# EAGLE design CC-USB-CB (EAGLE 6.1)
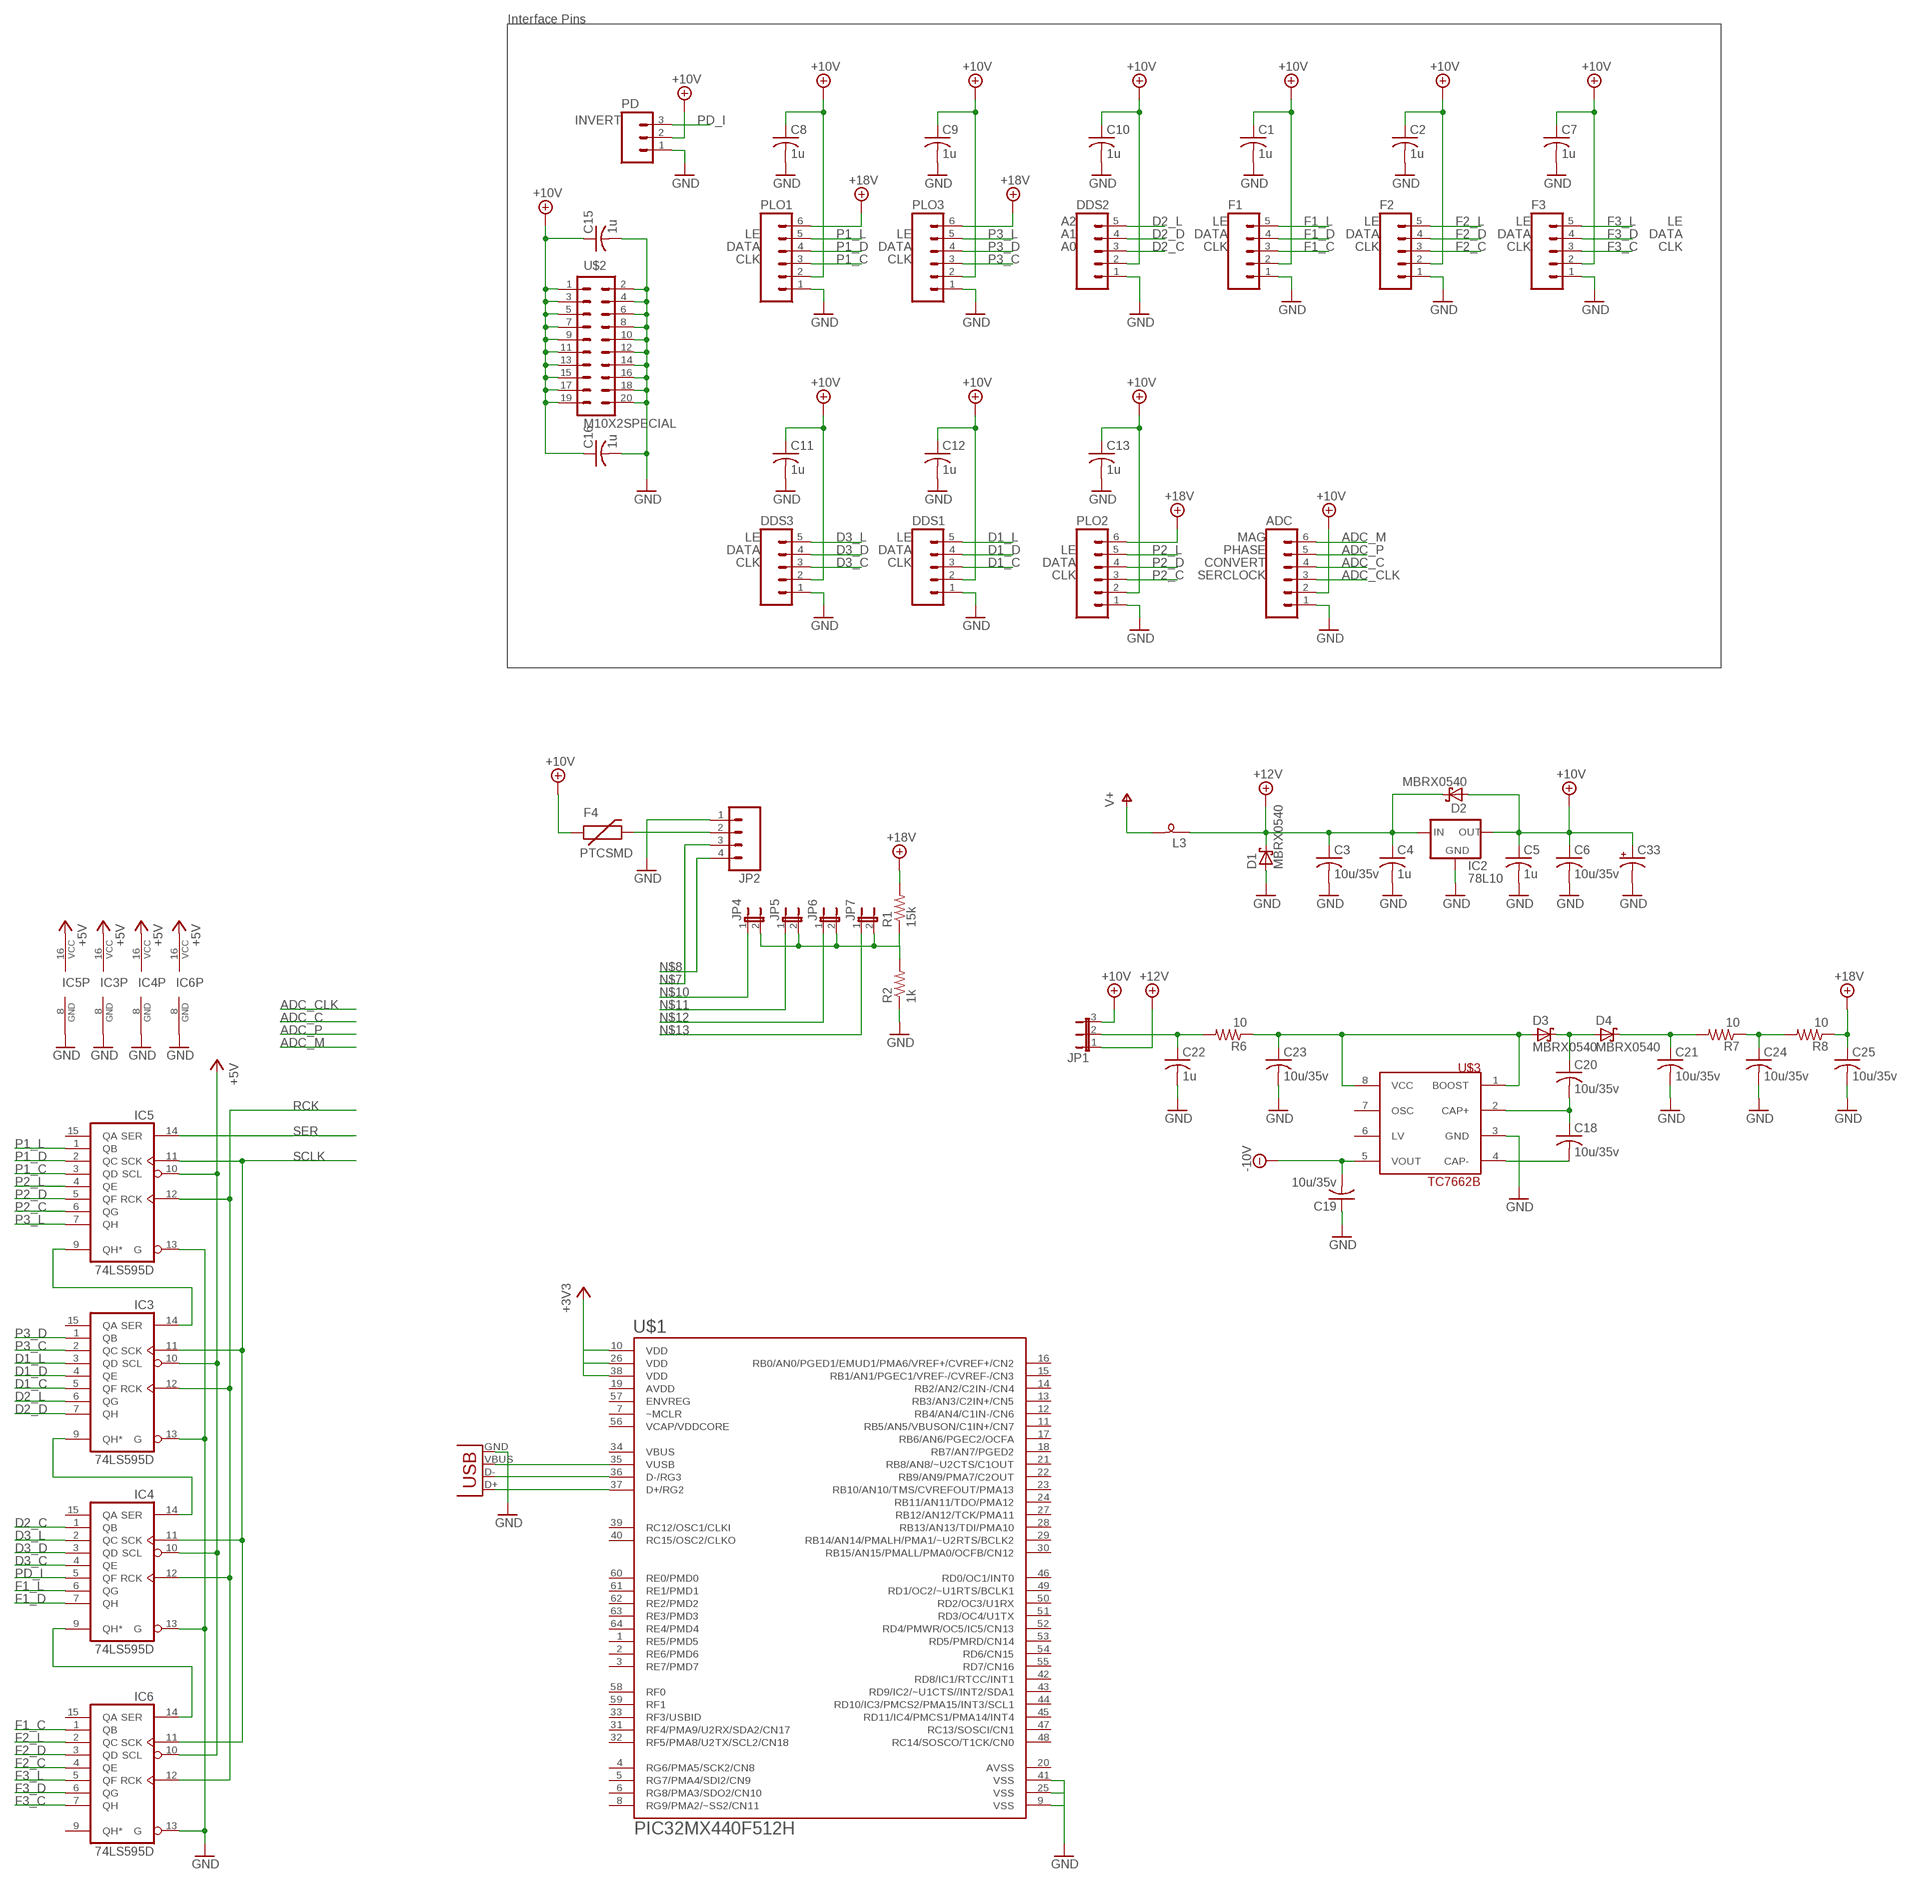
[diagram p0: schematic, sheet 1]

## Parts
ADC  M06LOCK  [1X06_LOCK]
C1  1u  C-USC0603  [C0603]
C2  1u  C-USC0603  [C0603]
C3  10u/35v  C-USC1206  [C1206]
C4  1u  C-USC0603  [C0603]
C5  1u  C-USC0603  [C0603]
C6  10u/35v  C-USC1206  [C1206]
C7  1u  C-USC0603  [C0603]
C8  1u  C-USC0603  [C0603]
C9  1u  C-USC0603  [C0603]
C10  1u  C-USC0603  [C0603]
C11  1u  C-USC0603  [C0603]
C12  1u  C-USC0603  [C0603]
C13  1u  C-USC0603  [C0603]
C15  1u  C-USC0603  [C0603]
C16  1u  C-USC0603  [C0603]
C18  10u/35v  C-USC1206  [C1206]
C19  10u/35v  C-USC1206  [C1206]
C20  10u/35v  C-USC1206  [C1206]
C21  10u/35v  C-USC1206  [C1206]
C22  1u  C-USC0603  [C0603]
C23  10u/35v  C-USC1206  [C1206]
C24  10u/35v  C-USC1206  [C1206]
C25  10u/35v  C-USC1206  [C1206]
C33  CPOL-USE2.5-6  [E2,5-6]
D1  MBRX0540  [SOD323-R]
D2  MBRX0540  [SOD323-R]
D3  MBRX0540  [SOD323-R]
D4  MBRX0540  [SOD323-R]
DDS1  M05LOCK  [1X05_LOCK]
DDS2  M05LOCK  [1X05_LOCK]
DDS3  M05LOCK  [1X05_LOCK]
F1  M05LOCK  [1X05_LOCK]
F2  M05LOCK  [1X05_LOCK]
F3  M05LOCK  [1X05_LOCK]
F4  PTCSMD  [PTC-1206]
IC2  78L10  78XXS  [78XXS]
IC3  74LS595D  [SO16]
IC4  74LS595D  [SO16]
IC5  74LS595D  [SO16]
IC6  74LS595D  [SO16]
JP1  JP2E  [JP2]
JP2  M04LOCK  [1X04_LOCK]
JP4  JUMPER-2SMD-NO  [SJ_2S-NO]
JP5  JUMPER-2SMD-NO  [SJ_2S-NO]
JP6  JUMPER-2SMD-NO  [SJ_2S-NO]
JP7  JUMPER-2SMD-NO  [SJ_2S-NO]
L3  SM-B5  [SM-B5]
PD  M03LOCK  [1X03_LOCK]
PLO1  M06LOCK  [1X06_LOCK]
PLO2  M06LOCK  [1X06_LOCK]
PLO3  M06LOCK  [1X06_LOCK]
R1  15k  R-US_R0603  [R0603]
R2  1k  R-US_R0603  [R0603]
R6  10  R-US_R0603  [R0603]
R7  10  R-US_R0603  [R0603]
R8  10  R-US_R0603  [R0603]
U$1  PIC32MX440F512H  [SQFP-S-10X10-64]
U$2  M10X2SPECIAL  [2X10_LOCK_SPECIAL]
U$3  TC7662B  [SO-08]
X1  USBPTH-VERTICAL  [USB-B-PTH-VERTICAL]

## Nets
+3V3: U$1.10(VDD) U$1.26(VDD) U$1.38(VDD)
+5V: IC3.10(SCL) IC3.16(VCC) IC4.10(SCL) IC4.16(VCC) IC5.10(SCL) IC5.16(VCC) IC6.10(SCL) IC6.16(VCC)
+10V: ADC.2 C1.1 C2.1 C5.1 C6.1 C7.1 C8.1 C9.1 C10.1 C11.1 C12.1 C13.1 C15.1 C16.1 C33.+ D2.A DDS1.2 DDS2.2 DDS3.2 F1.2 F2.2 F3.2 F4.1 IC2.OUT JP1.3 PD.2 PLO1.2 PLO2.2 PLO3.2 U$2.1 U$2.3 U$2.5 U$2.7 U$2.9 U$2.11 U$2.13 U$2.15 U$2.17 U$2.19
+12V: C3.1 C4.1 D1.C D2.C IC2.IN JP1.1 L3.1
+18V: C25.1 PLO1.6 PLO2.6 PLO3.6 R1.2 R8.1
-10V: C19.2 U$3.5(VOUT)
ADC_C: ADC.4
ADC_CLK: ADC.3
ADC_M: ADC.6
ADC_P: ADC.5
D1_C: DDS1.3 IC3.5(QF)
D1_D: DDS1.4 IC3.4(QE)
D1_L: DDS1.5 IC3.3(QD)
D2_C: DDS2.3 IC4.1(QB)
D2_D: DDS2.4 IC3.7(QH)
D2_L: DDS2.5 IC3.6(QG)
D3_C: DDS3.3 IC4.4(QE)
D3_D: DDS3.4 IC4.3(QD)
D3_L: DDS3.5 IC4.2(QC)
F1_C: F1.3 IC6.1(QB)
F1_D: F1.4 IC4.7(QH)
F1_L: F1.5 IC4.6(QG)
F2_C: F2.3 IC6.4(QE)
F2_D: F2.4 IC6.3(QD)
F2_L: F2.5 IC6.2(QC)
F3_C: F3.3 IC6.7(QH)
F3_D: F3.4 IC6.6(QG)
F3_L: F3.5 IC6.5(QF)
GND: ADC.1 C1.2 C2.2 C3.2 C4.2 C5.2 C6.2 C7.2 C8.2 C9.2 C10.2 C11.2 C12.2 C13.2 C15.2 C16.2 C19.1 C21.2 C22.2 C23.2 C24.2 C25.2 C33.- D1.A DDS1.1 DDS2.1 DDS3.1 F1.1 F2.1 F3.1 IC2.GND IC3.8(GND) IC3.13(G) IC4.8(GND) IC4.13(G) IC5.8(GND) IC5.13(G) IC6.8(GND) IC6.13(G) JP2.1 PD.1 PLO1.1 PLO2.1 PLO3.1 R2.1 U$1.9(VSS) U$1.25(VSS) U$1.41(VSS) U$2.2 U$2.4 U$2.6 U$2.8 U$2.10 U$2.12 U$2.14 U$2.16 U$2.18 U$2.20 U$3.3(GND) X1.GND
N$1: U$1.37(D+/RG2) X1.D+
N$2: U$1.36(D-/RG3) X1.D-
N$4: IC3.14(SER) IC5.9(QH*)
N$5: IC3.9(QH*) IC4.14(SER)
N$6: IC4.9(QH*) IC6.14(SER)
N$7: JP2.3
N$8: JP2.4
N$9: F4.2 JP2.2
N$10: JP4.1
N$11: JP5.1
N$12: JP6.1
N$13: JP7.1
N$14: JP4.2 JP5.2 JP6.2 JP7.2 R1.1 R2.2
N$15: U$1.35(VUSB) X1.VBUS
N$18: C22.1 JP1.2 R6.2
N$19: C23.1 D3.A R6.1 U$3.1(BOOST) U$3.8(VCC)
N$20: C18.2 U$3.4(CAP-)
N$21: C18.1 C20.2 U$3.2(CAP+)
N$22: C20.1 D3.C D4.A
N$23: C21.1 D4.C R7.2
N$24: C24.1 R7.1 R8.2
P1_C: IC5.3(QD) PLO1.3
P1_D: IC5.2(QC) PLO1.4
P1_L: IC5.1(QB) PLO1.5
P2_C: IC5.6(QG) PLO2.3
P2_D: IC5.5(QF) PLO2.4
P2_L: IC5.4(QE) PLO2.5
P3_C: IC3.2(QC) PLO3.3
P3_D: IC3.1(QB) PLO3.4
P3_L: IC5.7(QH) PLO3.5
PD_I: IC4.5(QF) PD.3
RCK: IC3.12(RCK) IC4.12(RCK) IC5.12(RCK) IC6.12(RCK)
SCLK: IC3.11(SCK) IC4.11(SCK) IC5.11(SCK) IC6.11(SCK)
SER: IC5.14(SER)
V+: L3.2
Unconnected: IC3.15(QA) IC4.15(QA) IC5.15(QA) IC6.9(QH*) IC6.15(QA) U$1.1(RE5/PMD5) U$1.2(RE6/PMD6) U$1.3(RE7/PMD7) U$1.4(RG6/PMA5/SCK2/CN8) U$1.5(RG7/PMA4/SDI2/CN9) U$1.6(RG8/PMA3/SDO2/CN10) U$1.7(~MCLR) U$1.8(RG9/PMA2/~SS2/CN11) U$1.11(RB5/AN5/VBUSON/C1IN+/CN7) U$1.12(RB4/AN4/C1IN-/CN6) U$1.13(RB3/AN3/C2IN+/CN5) U$1.14(RB2/AN2/C2IN-/CN4) U$1.15(RB1/AN1/PGEC1/VREF-/CVREF-/CN3) U$1.16(RB0/AN0/PGED1/EMUD1/PMA6/VREF+/CVREF+/CN2) U$1.17(RB6/AN6/PGEC2/OCFA) U$1.18(RB7/AN7/PGED2) U$1.19(AVDD) U$1.20(AVSS) U$1.21(RB8/AN8/~U2CTS/C1OUT) U$1.22(RB9/AN9/PMA7/C2OUT) U$1.23(RB10/AN10/TMS/CVREFOUT/PMA13) U$1.24(RB11/AN11/TDO/PMA12) U$1.27(RB12/AN12/TCK/PMA11) U$1.28(RB13/AN13/TDI/PMA10) U$1.29(RB14/AN14/PMALH/PMA1/~U2RTS/BCLK2) U$1.30(RB15/AN15/PMALL/PMA0/OCFB/CN12) U$1.31(RF4/PMA9/U2RX/SDA2/CN17) U$1.32(RF5/PMA8/U2TX/SCL2/CN18) U$1.33(RF3/USBID) U$1.34(VBUS) U$1.39(RC12/OSC1/CLKI) U$1.40(RC15/OSC2/CLKO) U$1.42(RD8/IC1/RTCC/INT1) U$1.43(RD9/IC2/~U1CTS//INT2/SDA1) U$1.44(RD10/IC3/PMCS2/PMA15/INT3/SCL1) U$1.45(RD11/IC4/PMCS1/PMA14/INT4) U$1.46(RD0/OC1/INT0) U$1.47(RC13/SOSCI/CN1) U$1.48(RC14/SOSCO/T1CK/CN0) U$1.49(RD1/OC2/~U1RTS/BCLK1) U$1.50(RD2/OC3/U1RX) U$1.51(RD3/OC4/U1TX) U$1.52(RD4/PMWR/OC5/IC5/CN13) U$1.53(RD5/PMRD/CN14) U$1.54(RD6/CN15) U$1.55(RD7/CN16) U$1.56(VCAP/VDDCORE) U$1.57(ENVREG) U$1.58(RF0) U$1.59(RF1) U$1.60(RE0/PMD0) U$1.61(RE1/PMD1) U$1.62(RE2/PMD2) U$1.63(RE3/PMD3) U$1.64(RE4/PMD4) U$3.6(LV) U$3.7(OSC)

## Notes on the sheet
- Interface Pins
- INVERT
- A2 | LE | LE | LE | LE
- LE | LE | A1 | DATA | DATA | DATA | DATA
- DATA | DATA | A0 | CLK | CLK | CLK | CLK
- CLK | CLK
- LE | LE | MAG
- DATA | DATA | LE | PHASE
- CLK | CLK | DATA | CONVERT
- CLK | SERCLOCK

## Library data of the parts
ADC PLO1-PLO3 = SparkFun:M06: Header 6 Standard 6-pin 0.1" header. Use with straight break away headers (SKU : PRT-00116), right angle break away headers (PRT-00553), swiss pins (PRT-00743), machine pins (PRT-00117), and female headers (PRT-00115). Molex polarized connector foot print use with SKU : PRT-08094 with associated crimp pins and housings. NOTES ON THE VARIANTS LOCK and LOCK_LONGPADS... This footprint was designed to help hold the alignment of a through-hole component (i.e. 6-pin header) while soldering it into place. You may notice that each hole has been shifted either up or down by 0.005 of an inch from it's more standard position (which is a perfectly straight line). This slight alteration caused the pins (the squares in the middle) to touch the edges of the holes. Because they are alternating, it causes a "brace" to hold the component in place. 0.005 has proven to be the perfect amount of "off-center" position when using our standard breakaway headers. Although looks a little odd when you look at the bare footprint, once you have a header in there, the alteration is very hard to notice. Also, if you push a header all the way into place, it is covered up entirely on the bottom side. This idea of altering the position of holes to aid alignment will be further integrated into the Sparkfun Library for other footprints. It can help hold any component with 3 or more connection pins.
C1-C13 C15 C16 C18-C25 = rcl:C-US: CAPACITOR, American symbol
C33 = rcl:CPOL-US: POLARIZED CAPACITOR, American symbol
D1-D4 = Misc:MBRX0540
DDS1-DDS3 F1-F3 = SparkFun:M05: Header 5 Standard 5-pin 0.1" header. Use with straight break away headers (SKU : PRT-00116), right angle break away headers (PRT-00553), swiss pins (PRT-00743), machine pins (PRT-00117), and female headers (PRT-00115). Molex polarized connector foot print use with SKU : PRT-08230 with associated crimp pins and housings.
F4 = SparkFun:PTC: Resettable Fuse PTC Resettable Fuse. Spark Fun Electronics SKU : COM-08357
IC2 = v-reg:78XXS: VOLTAGE REGULATOR
IC3-IC6 = 74xx-us:74*595: 8-bit SHIFT REGISTER, output latch
JP1 = jumper:JP2E: JUMPER
JP2 = SparkFun:M04: Header 4 Standard 4-pin 0.1" header. Use with straight break away headers (SKU : PRT-00116), right angle break away headers (PRT-00553), swiss pins (PRT-00743), machine pins (PRT-00117), and female headers (PRT-00115). Molex polarized connector foot print use with SKU : PRT-08231 with associated crimp pins and housings. 1MM SMD Version SKU: PRT-10208
JP4-JP7 = SparkFun:JUMPER-2: Jumper Basic 0.1" spaced jumper. Use with breakaway headers.
L3 = inductor-neosid:SM-B: INDUCTOR SMD Bead inductor; OC_FARNELL: unknown; OC_NEWARK: unknown
PD = SparkFun:M03: Header 3 Standard 3-pin 0.1" header. Use with straight break away headers (SKU : PRT-00116), right angle break away headers (PRT-00553), swiss pins (PRT-00743), machine pins (PRT-00117), and female headers (PRT-00115). Molex polarized connector foot print use with SKU : PRT-08232 with associated crimp pins and housings.
R1 R2 R6-R8 = rcl:R-US_: RESISTOR, American symbol
U$1 = SparkFun:PIC32MX440F512H
U$2 = SparkFun:M10X2: This was SPECIALLY designed to be used with our Graphic LCD Backpack. Be sure you want to use this! It is not only staggered on each line of header holes, but IT IS ALSO offset of the center point of the top and bottom lines by 5 mil. This causes the headers to lock into place on the "standard" footprint on the LCD screen. The extra squares on the tdocu layer are there simply to reference other pins (if you were to actually populate a longer header than ten long - this is what we do with the backpacks).
U$3 = microchip:TC7662B
X1 = SparkFun:USB: USB Connectors USB-B-PTH is fully proven SKU : PRT-00139 USB-miniB is fully proven SKU : PRT-00587 USB-A-PCB is untested. USB-A-H is throughly reviewed, but untested. Spark Fun Electronics SKU : PRT-00437 USB-B-SMT is throughly reviewed, but untested. Needs silkscreen touching up. USB-A-S has not been used/tested USB-MB-H has not been used/tested

## Board
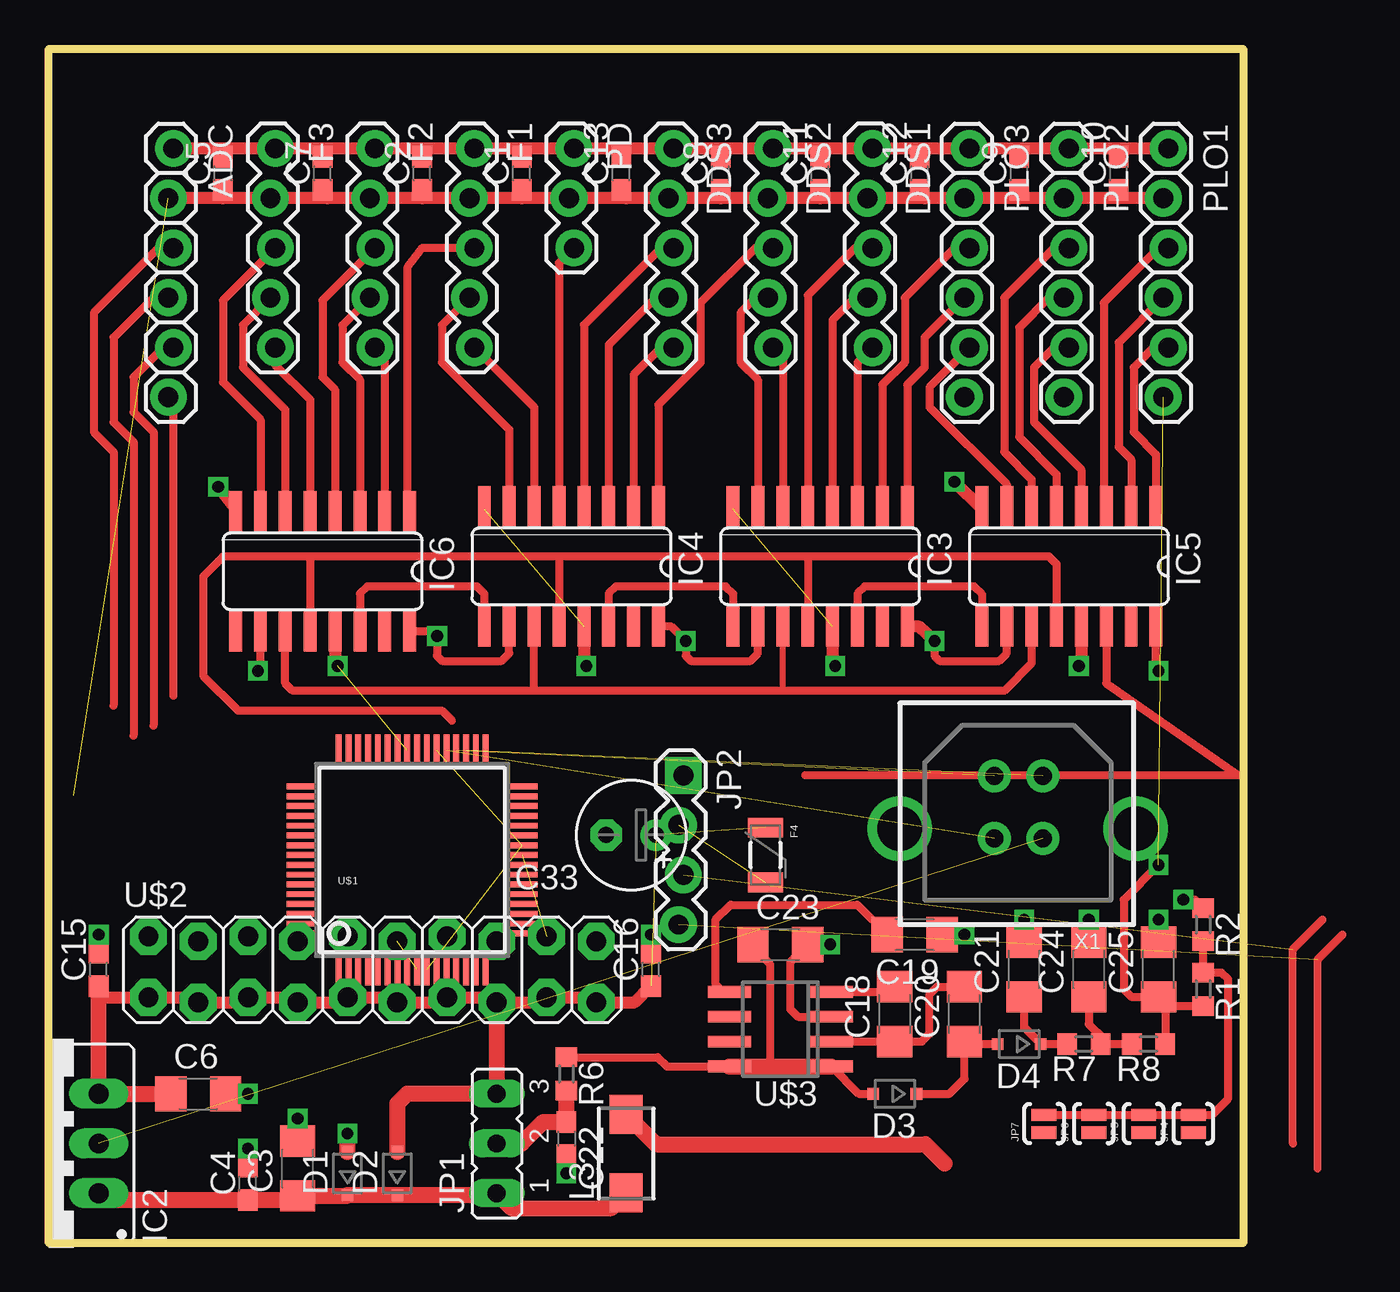
[diagram p1: board, top side]
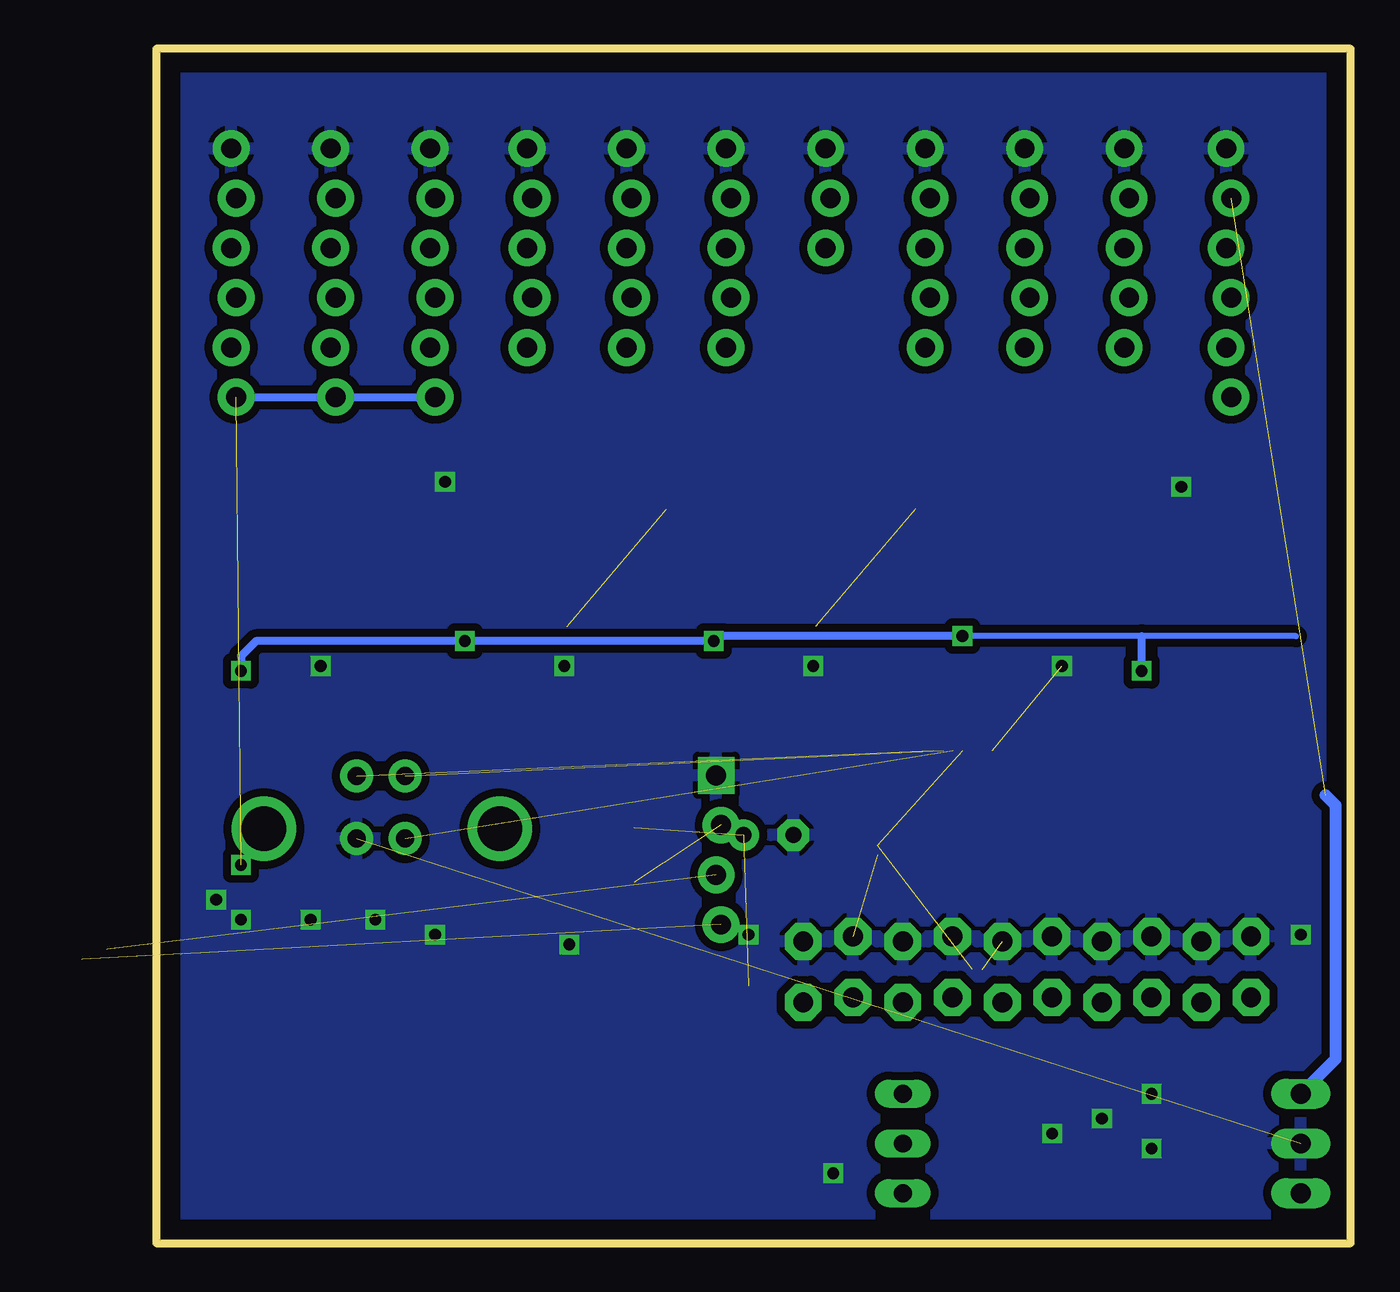
[diagram p2: board, bottom side, seen from below]

Size 60.96 x 60.96 mm. Coordinates in mm from the lower left corner, seen from the top.
Outline: 0,60.96 60.96,60.96 60.96,0 0,0 0,60.96
Copper layers (1*16): Top 0.035mm / dielectric 1.5mm / Bottom 0.035mm
Design rules: minimum track width 10mil, minimum drill 24mil, track to track 8mil, track to pad 8mil, pad to pad 8mil, via to via 8mil, smd to smd 8mil, copper to edge 40mil, drill to drill 8mil, minimum pad ring 10mil, minimum via ring 8mil, stop-mask expansion 4mil, vias tented up to drill 0mil, thermal gap 10mil

### Footprints (pad centres in the part's own frame; a part is rotated, then mirrored left to right if it is on the bottom)
1X06_LOCK = drill 1.016 pad 1.88: 1 0,0; 2 2.54,-0.254; 3 5.08,0; 4 7.62,-0.254; 5 10.16,0; 6 12.7,-0.254
C0603 = smd 1.1 x 1: 1 -0.85,0; 2 0.85,0
C1206 = smd 1.6 x 1.8: 1 -1.4,0; 2 1.4,0
E2,5-6 = drill 0.813 pad 1.6: + -1.27,0 | drill 0.813 pad 1.6 octagon: - 1.27,0
SOD323-R = smd 0.6 x 0.6: A 1.1,0; C -1.1,0
1X05_LOCK = drill 1.016 pad 1.88: 1 0,0.127; 2 2.54,-0.127; 3 5.08,0.127; 4 7.62,-0.127; 5 10.16,0.127
PTC-1206 = smd 1 x 1.8: 1 -1.4,0; 2 1.4,0
78XXS = drill 1.016 long: GND 0,-2.54; IN -2.54,-2.54; OUT 2.54,-2.54
SO16 = smd 0.66 x 2.032: 1 -4.445,-3.073; 2 -3.175,-3.073; 3 -1.905,-3.073; 4 -0.635,-3.073; 5 0.635,-3.073; 6 1.905,-3.073; 7 3.175,-3.073; 8 4.445,-3.073; 9 4.445,3.073; 10 3.175,3.073; 11 1.905,3.073; 12 0.635,3.073; 13 -0.635,3.073; 14 -1.905,3.073; 15 -3.175,3.073; 16 -4.445,3.073
JP2 = drill 0.914 long: 1 -2.54,0; 2 0,0; 3 2.54,0
1X04_LOCK = drill 1.016 pad 1.88 square: 1 0,0.127 | drill 1.016 pad 1.88: 2 2.54,-0.127; 3 5.08,0.127; 4 7.62,-0.127
SJ_2S-NO = smd 0.635 x 1.27: 1 -0.45,0; 2 0.45,0
SM-B5 = smd 2 x 1.7: 1 -2,0; 2 2,0
1X03_LOCK = drill 1.016 pad 1.88: 1 0,0.127; 2 2.54,-0.127; 3 5.08,0.127
R0603 = smd 1 x 1.1: 1 -0.85,0; 2 0.85,0
SQFP-S-10X10-64 = smd 0.3 x 1.6: 1 -3.75,-5.6; 2 -3.25,-5.6; 3 -2.75,-5.6; 4 -2.25,-5.6; 5 -1.75,-5.6; 6 -1.25,-5.6; 7 -0.75,-5.6; 8 -0.25,-5.6; 9 0.25,-5.6; 10 0.75,-5.6; 11 1.25,-5.6; 12 1.75,-5.6; 13 2.25,-5.6; 14 2.75,-5.6; 15 3.25,-5.6; 16 3.75,-5.6; 33 3.75,5.6; 34 3.25,5.6; 35 2.75,5.6; 36 2.25,5.6; 37 1.75,5.6; 38 1.25,5.6; 39 0.75,5.6; 40 0.25,5.6; 41 -0.25,5.6; 42 -0.75,5.6; 43 -1.25,5.6; 44 -1.75,5.6; 45 -2.25,5.6; 46 -2.75,5.6; 47 -3.25,5.6; 48 -3.75,5.6 | smd 1.6 x 0.3: 17 5.6,-3.75; 18 5.6,-3.25; 19 5.6,-2.75; 20 5.6,-2.25; 21 5.6,-1.75; 22 5.6,-1.25; 23 5.6,-0.75; 24 5.6,-0.25; 25 5.6,0.25; 26 5.6,0.75; 27 5.6,1.25; 28 5.6,1.75; 29 5.6,2.25; 30 5.6,2.75; 31 5.6,3.25; 32 5.6,3.75; 49 -5.6,3.75; 50 -5.6,3.25; 51 -5.6,2.75; 52 -5.6,2.25; 53 -5.6,1.75; 54 -5.6,1.25; 55 -5.6,0.75; 56 -5.6,0.25; 57 -5.6,-0.25; 58 -5.6,-0.75; 59 -5.6,-1.25; 60 -5.6,-1.75; 61 -5.6,-2.25; 62 -5.6,-2.75; 63 -5.6,-3.25; 64 -5.6,-3.75
2X10_LOCK_SPECIAL = drill 1.016 pad 1.88 octagon: 1 -11.43,-1.422; 2 -11.43,1.676; 3 -8.89,-1.676; 4 -8.89,1.422; 5 -6.35,-1.422; 6 -6.35,1.676; 7 -3.81,-1.676; 8 -3.81,1.422; 9 -1.27,-1.422; 10 -1.27,1.676; 11 1.27,-1.676; 12 1.27,1.422; 13 3.81,-1.422; 14 3.81,1.676; 15 6.35,-1.676; 16 6.35,1.422; 17 8.89,-1.422; 18 8.89,1.676; 19 11.43,-1.676; 20 11.43,1.422
SO-08 = smd 0.6 x 2.2: 1 -1.905,-2.6; 2 -0.635,-2.6; 3 0.635,-2.6; 4 1.905,-2.6; 5 1.905,2.6; 6 0.635,2.6; 7 -0.635,2.6; 8 -1.905,2.6
USB-B-PTH-VERTICAL = drill 0.914 pad 1.676: D+ 4.826,4.394; D- 4.826,7.595; GND 7.315,4.394; VBUS 7.315,7.595 | drill 2.286: P$1 0,4.902; P$2 12.04,4.902

### Placement (x,y rotation side)
ADC  6.35,55.88 270 top
C1  24.13,54.61 90 top
C2  19.05,54.61 90 top
C3  12.7,3.81 90 top
C4  10.16,3.05 90 top
C5  8.89,54.61 90 top
C6  7.62,7.62 0 top
C7  13.97,54.61 90 top
C8  34.29,54.61 90 top
C9  49.53,54.61 90 top
C10  54.61,54.61 90 top
C11  39.37,54.61 90 top
C12  44.45,54.61 90 top
C13  29.21,54.61 90 top
C15  2.54,13.97 90 top
C16  30.73,13.97 90 top
C18  43.18,11.68 90 top
C19  44.2,15.75 180 top
C20  46.74,11.68 90 top
C21  49.78,13.97 90 top
C22  26.42,5.33 270 top
C23  37.34,15.24 0 top
C24  53.09,13.97 90 top
C25  56.64,13.97 90 top
C33  29.72,20.83 180 top
D1  15.24,3.56 90 top
D2  17.78,3.56 90 top
D3  43.18,7.62 180 top
D4  49.53,10.16 180 top
DDS1  41.91,55.88 270 top
DDS2  36.83,55.88 270 top
DDS3  31.75,55.88 270 top
F1  21.59,55.88 270 top
F2  16.51,55.88 270 top
F3  11.43,55.88 270 top
F4  36.58,19.81 270 top
IC2  0,5.08 90 top
IC3  39.37,34.54 180 top
IC4  26.67,34.54 180 top
IC5  52.07,34.54 180 top
IC6  13.97,34.29 180 top
JP1  22.86,5.08 90 top
JP2  32.26,23.88 270 top
JP4  58.42,6.1 90 top
JP5  55.88,6.1 90 top
JP6  53.34,6.1 90 top
JP7  50.8,6.1 90 top
L3  29.46,4.57 90 top
PD  26.67,55.88 270 top
PLO1  57.15,55.88 270 top
PLO2  52.07,55.88 270 top
PLO3  46.99,55.88 270 top
R1  58.93,12.95 270 top
R2  58.93,16.26 270 top
R6  26.42,8.64 270 top
R7  52.83,10.16 180 top
R8  56.13,10.16 180 top
U$1  18.54,19.56 0 top
U$2  16.51,13.97 0 top
U$3  37.34,10.92 90 top
X1  43.43,16.26 0 top

### Tracks (layer width: path | path; a pad name or v marks a point on that pad's centre or on a via)
+3V3  (2 unrouted)
+5V  (via drill 0.6)
  Top 0.406: IC4.16 31.77,31.47 v32.51,30.73 32.51,29.97 32.77,29.72 35.81,29.72 36.2,30.1 IC3.10 | IC6.16 19.58,31.22 v19.81,30.99 19.81,29.97 20.07,29.72 23.11,29.72 23.5,30.1 IC4.10 | IC5.10 48.9,30.1 48.51,29.72 45.47,29.72 45.21,29.97 v45.21,30.73 | IC6.10 10.79,29.34 v10.67,29.21 | IC5.16 56.52,29.34 v56.64,29.21
  Top 0.61: IC3.16 44.42,31.47 v45.21,30.73
  Bottom 0.305: 2.79,30.99 10.67,30.99 v19.81,30.99
  Bottom 0.406: v56.64,29.21 56.64,29.97 55.88,30.73 v45.21,30.73 v32.51,30.73 32.26,30.99 v19.81,30.99 | 10.67,30.99 v10.67,29.21
+10V  (3 unrouted)
  Top 0.61: 54.61,53.34 PLO2.2 49.53,53.34 | 49.53,53.34 PLO3.2 44.7,53.34 | 44.7,53.34 DDS1.2 39.37,53.34 | 39.37,53.34 DDS2.2 34.29,53.34 | 34.29,53.34 DDS3.2 29.46,53.34 | 24.13,53.34 F1.2 19.05,53.34 | 19.05,53.34 F2.2 14.22,53.34 | 14.22,53.34 F3.2 8.89,53.34 | C7.1 13.97,53.59 14.22,53.34 | 19.05,53.34 C2.1 | 24.13,53.34 C1.1 | C13.1 29.21,53.59 29.46,53.34 | 34.29,53.34 C8.1 | 39.37,53.34 C11.1 | C12.1 44.45,53.59 44.7,53.34 | 49.53,53.34 C9.1 | 54.61,53.34 C10.1 | C16.1 29.91,12.29 U$2.19 27.69,12.55 U$2.17 25.15,12.29 U$2.15 22.61,12.55 U$2.13 20.07,12.29 U$2.11 17.53,12.55 U$2.9 14.99,12.29 U$2.7 12.45,12.55 U$2.5 9.91,12.29 U$2.3 7.37,12.55 U$2.1 2.69,12.55 2.54,12.7 | 24.13,53.34 PD.2 29.46,53.34 | 8.89,53.34 ADC.2 | 8.89,53.34 C5.1 | 2.54,12.61 C15.1 | PLO1.2 54.61,53.34
  Top 0.813: 2.54,12.7 2.54,12.61 IC2.OUT C6.1 | D2.A 17.78,7.11 18.29,7.62 JP1.3 U$2.15
  Bottom 0.61: 1.27,22.86 0.76,22.35 0.76,9.4 IC2.OUT
+12V
  Top 0.813: IC2.IN 2.88,2.2 C4.1 12.49,2.2 C3.1 15.19,2.41 D1.C D2.C 22.78,2.46 JP1.1 23.62,1.78 28.7,1.78 29.46,2.54 L3.1
+18V  (via drill 0.6)  (1 unrouted)
  Top 0.406: R8.1 56.98,12.23 C25.1 | R1.2 57.11,12.1 C25.1 | C25.1 55.25,12.57 54.86,12.95 54.86,17.53 v56.64,19.3
  Bottom 0.406: PLO1.6 PLO2.6 PLO3.6
-10V
  Top 0.406: U$3.5 34.42,12.83 34.04,13.21 34.04,16.51 34.8,17.27 41.27,17.27 C19.2
ADC_C
  Top 0.406: ADC.4 5.33,48.26 3.3,46.23 3.3,41.91 4.32,40.89 4.32,25.91
ADC_CLK
  Top 0.406: ADC.3 5.59,50.8 2.29,47.5 2.29,41.4 3.3,40.39 3.3,27.43
ADC_M
  Top 0.406: ADC.6 6.35,42.93 6.35,27.94
ADC_P
  Top 0.406: ADC.5 5.84,45.72 4.32,44.2 4.32,42.42 5.33,41.4 5.33,26.42
D1_C
  Top 0.406: IC3.5 38.73,48.39 41.15,50.8 DDS1.3
D1_D
  Top 0.406: IC3.4 40.01,47.12 41.15,48.26 DDS1.4
D1_L
  Top 0.406: IC3.3 41.27,44.96 DDS1.5
D2_C
  Top 0.406: IC4.1 31.11,42.8 33.27,44.96 33.27,48.01 36.07,50.8 DDS2.3
D2_D
  Top 0.406: DDS2.4 36.07,48.26 35.31,47.5 35.31,44.96 36.2,44.07 IC3.7
D2_L
  Top 0.406: IC3.6 37.47,45.21 DDS2.5
D3_C
  Top 0.406: IC4.4 27.3,46.86 31.24,50.8 DDS3.3
D3_D
  Top 0.406: IC4.3 28.57,45.85 30.99,48.26 DDS3.4
D3_L
  Top 0.406: IC4.2 29.84,44.32 31.24,45.72 DDS3.5
F1_C
  Top 0.406: F1.3 19.05,50.8 18.29,49.78 18.29,37.49 IC6.1
F1_D
  Top 0.406: IC4.7 23.5,41.53 20.07,44.96 20.07,46.86 F1.4
F1_L
  Top 0.406: IC4.6 24.77,42.67 F1.5
F2_C
  Top 0.406: IC6.4 14.61,43.56 13.97,44.2 13.97,48.13 F2.3
F2_D
  Top 0.406: IC6.3 15.88,44.07 14.99,44.96 14.99,46.86 F2.4
F2_L
  Top 0.406: IC6.2 17.14,45.09 16.64,45.59 F2.5
F3_C
  Top 0.406: IC6.7 10.79,42.04 8.89,43.94 8.89,48.13 F3.3
F3_D
  Top 0.406: IC6.6 12.06,42.55 9.91,44.7 9.91,46.86 F3.4
F3_L
  Top 0.406: IC6.5 13.34,43.05 11.56,44.83 F3.5
GND  (via drill 0.6)  (6 unrouted)
  Top 0.406: v39.88,15.24 C23.2 37.85,14.35 37.85,11.94 38.23,11.56 U$3.3 | C19.1 v46.74,15.75 | C24.2 v53.09,16.51 | C25.2 v56.64,16.51 | v57.91,17.53 58.51,17.53 R2.1 | C15.2 v2.54,15.75
  Top 0.61: PLO1.1 54.36,55.88 | 54.36,55.88 PLO2.1 49.53,55.88 | 49.53,55.88 PLO3.1 44.45,55.88 | C10.2 54.61,55.63 54.36,55.88 | 49.53,55.88 C9.2 | 44.45,55.88 C12.2 | 44.45,55.88 39.37,55.88 | 39.37,55.88 DDS2.1 34.29,55.88 | 34.29,55.88 DDS3.1 29.21,55.88 | 39.37,55.88 C11.2 | 34.29,55.88 C8.2 | 24.13,55.88 F1.1 18.8,55.88 | 18.8,55.88 F2.1 13.72,55.88 | 24.13,55.88 C1.2 | C2.2 19.05,55.63 18.8,55.88 | 13.72,55.88 F3.1 | C7.2 13.97,55.63 13.72,55.88 | C6.2 v10.16,7.62 | C4.2 v10.16,4.83 | C3.2 v12.7,6.35 | C16.2 v30.73,15.75 | C21.2 v49.78,16.51 | IC5.8 47.62,37.47 v46.23,38.86 | IC3.8 34.92,37.47 | IC4.8 22.23,37.47 | IC6.8 9.53,37.47 v8.64,38.61 | IC5.13 52.7,29.59 v52.58,29.46 | IC3.13 40.01,29.59 v40.13,29.46 | IC4.13 27.3,29.59 v27.43,29.46 | IC6.13 14.61,29.59 v14.73,29.46 | 11.43,55.88 8.89,55.88 | 8.89,55.88 ADC.1 | 8.89,55.88 C5.2 | 29.21,55.88 24.13,55.88 | 29.21,55.88 C13.2
  Top 0.813: D1.A v15.24,5.59 | C22.2 v26.42,3.56
  pour Bottom (isolate 0.406): 0,60.96 0,0 60.96,0.25 60.96,60.96
N$1  (1 unrouted)
N$2  (1 unrouted)
N$4
  Top 0.406: IC5.9 47.62,33.15 47.24,33.53 41.66,33.53 41.27,33.15 IC3.14
N$5
  Top 0.406: IC3.9 34.92,33.15 34.54,33.53 28.96,33.53 28.57,33.15 IC4.14
N$6
  Top 0.406: IC6.14 15.88,33.15 16.26,33.53 21.84,33.53 22.23,33.15 IC4.9
N$7  (1 unrouted)
  Top 0.406: 65.02,16.51 63.5,14.99 63.5,5.08
N$8  (1 unrouted)
  Top 0.406: 66.04,15.75 64.77,14.48 64.77,3.81
N$9  (1 unrouted)
N$14
  Top 0.406: JP7.2 JP6.2 JP5.2 JP4.2 59.38,6.55 60.2,7.37 60.2,13.46 59.86,13.8 R1.1 R2.2
N$15  (1 unrouted)
N$18
  Top 0.813: JP1.2 24.13,5.08 25.23,6.18 C22.1 R6.2
N$19
  Top 0.406: R6.1 31.08,9.49 31.55,9.02 U$3.8 | 35.81,15.24 36.83,14.22 36.83,9.27 37.08,9.02 | D3.A 41.34,7.62 U$3.1
  Top 0.813: U$3.8 37.08,9.02 U$3.1 | 35.81,15.24 C23.1
N$20
  Top 0.406: U$3.4 42.92,12.83 C18.2
N$21
  Top 0.406: U$3.2 C18.1 44.57,10.28 44.96,10.67 44.96,12.7 45.34,13.08 C20.2
N$22
  Top 0.406: D3.C 45.97,7.62 46.74,8.38 C20.1 46.86,10.16 D4.A
N$23
  Top 0.406: C21.1 49.78,11.01 D4.C R7.2
N$24
  Top 0.406: R8.2 R7.1 53.85,10.33 53.85,10.41 53.09,11.18 C24.1
P1_C
  Top 0.406: PLO1.3 56.64,50.8 53.85,48.01 53.85,37.74 IC5.3
P1_D
  Top 0.406: IC5.2 55.24,40.01 54.61,40.64 54.61,45.97 PLO1.4
P1_L
  Top 0.406: IC5.1 56.52,40.26 55.37,41.4 55.37,44.7 56.39,45.72 PLO1.5
P2_C
  Top 0.406: IC5.6 50.16,38.99 48.77,40.39 48.77,48.26 51.31,50.8 PLO2.3
P2_D
  Top 0.406: IC5.5 51.44,39.24 49.53,41.15 49.53,46.74 51.05,48.26 PLO2.4
P2_L
  Top 0.406: IC5.4 52.7,39.5 50.29,41.91 50.29,44.7 51.31,45.72 PLO2.5
P3_C
  Top 0.406: IC3.2 42.55,43.81 43.69,44.96 43.69,48.26 46.23,50.8 PLO3.3
P3_D
  Top 0.406: IC3.1 43.81,43.81 44.7,44.7 44.7,46.23 PLO3.4
P3_L
  Top 0.406: PLO3.5 44.96,43.69 44.96,42.67 48.9,38.73 IC5.7
PD_I
  Top 0.406: IC4.5 26.04,50.04 PD.3
RCK
  Top 0.406: IC5.12 51.44,34.67 51.05,35.05 38.86,35.05 | 38.86,35.05 26.16,35.05 | IC4.12 26.04,34.92 26.16,35.05 | IC3.12 38.73,34.92 38.86,35.05 | IC6.12 13.34,34.92 13.21,35.05 | 26.16,35.05 13.21,35.05 | 20.57,26.67 20.07,27.18 9.65,27.18 7.87,28.96 7.87,34.04 8.89,35.05 13.21,35.05
SCLK
  Top 0.305: IC3.11 37.47,28.32 37.59,28.19
  Top 0.406: IC4.11 24.77,28.32 24.64,28.19 | 24.64,28.19 37.59,28.19 48.77,28.19 50.16,29.59 IC5.11 | IC6.11 12.06,28.57 12.45,28.19 24.64,28.19
SER
  Top 0.406: IC5.14 53.98,28.57 60.71,23.88 38.61,23.88
V+
  Top 0.813: 45.72,4.06 44.74,5.05 30.99,5.05 L3.2

### Text on the board
_tsilk: Digital I/O | Digital I/O | ARef | gnd | 13 | 12 | 11 | 10 | 9 | 8 | 7 | 6 | 5 | 4 | 3 | 2 | 1 | 0 | 74LS595D | 74LS595D | 74LS595D | 74LS595D | 74LS595D | PLO1 | PLO2 | PLO3 | ADC | DDS1 | DDS2 | DDS3 | F1 | F2 | F3 | F4 | PD | 10u/35v | 10u/35v | 10 | 10 | 10u/35v | 10u/35v | D4 | 10u/35v | 1u | 1u | 1u | D3 | 10u/35v | 10u/35v | 10 | 10u/35v | L3 | 10u/35v | D2 | 1u | D1 | 78L10 | TC7662B | RST | 3v | 5v | Gnd | Vin | 0 | 1 | 2 | 3 | 4 | 5 | C33 | Analog In
_bsilk: 1k | R2 | R1 | 15k | JP7 | JP6 | JP5 | JP4 | JP3 | JP2